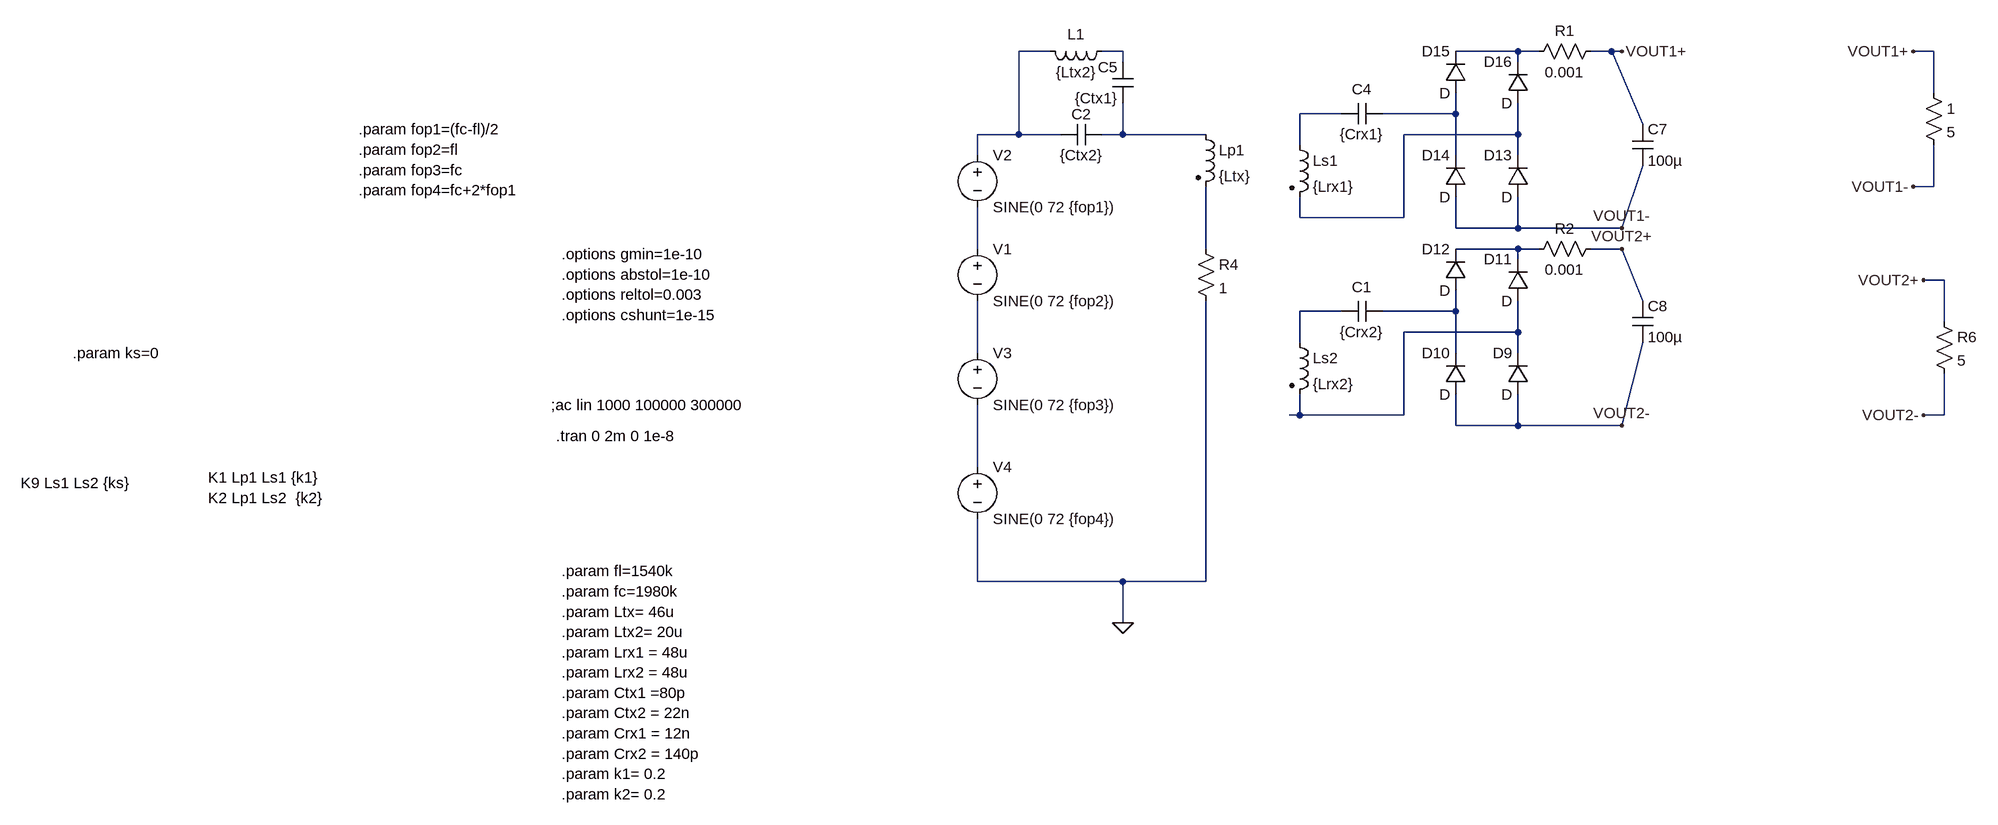
[diagram p0: schematic 1p2S_sine.asc]
1p2S_sine.asc, the LTspice schematic file:
Version 4
SHEET 1 3864 3572
WIRE 960 512 912 512
WIRE 1072 512 1040 512
WIRE 1680 512 1584 512
WIRE 1712 512 1680 512
WIRE 1824 512 1792 512
WIRE 1840 512 1824 512
WIRE 2320 512 2288 512
WIRE 1072 528 1072 512
WIRE 1680 528 1680 512
WIRE 2320 576 2320 512
WIRE 1408 608 1344 608
WIRE 1584 608 1584 576
WIRE 1584 608 1472 608
WIRE 1872 624 1824 512
WIRE 912 640 912 512
WIRE 912 640 848 640
WIRE 976 640 912 640
WIRE 1072 640 1072 592
WIRE 1072 640 1040 640
WIRE 1200 640 1072 640
WIRE 1680 640 1680 592
WIRE 1680 640 1504 640
WIRE 1344 656 1344 608
WIRE 848 672 848 640
WIRE 1584 672 1584 608
WIRE 1680 672 1680 640
WIRE 2320 720 2320 656
WIRE 2320 720 2288 720
WIRE 1344 768 1344 736
WIRE 1504 768 1504 640
WIRE 1504 768 1344 768
WIRE 1584 784 1584 736
WIRE 1680 784 1680 736
WIRE 1680 784 1584 784
WIRE 1840 784 1872 688
WIRE 1840 784 1680 784
WIRE 848 816 848 752
WIRE 1200 816 1200 720
WIRE 1680 816 1584 816
WIRE 1712 816 1680 816
WIRE 1840 816 1792 816
WIRE 1680 832 1680 816
WIRE 2336 864 2304 864
WIRE 1872 896 1840 816
WIRE 1408 912 1344 912
WIRE 1584 912 1584 880
WIRE 1584 912 1472 912
WIRE 2336 928 2336 864
WIRE 1680 944 1680 896
WIRE 1680 944 1504 944
WIRE 1344 960 1344 912
WIRE 848 976 848 896
WIRE 1584 976 1584 912
WIRE 1680 976 1680 944
WIRE 1344 1072 1344 1040
WIRE 1344 1072 1328 1072
WIRE 1504 1072 1504 944
WIRE 1504 1072 1344 1072
WIRE 2336 1072 2336 1008
WIRE 2336 1072 2304 1072
WIRE 1584 1088 1584 1040
WIRE 1680 1088 1680 1040
WIRE 1680 1088 1584 1088
WIRE 1840 1088 1872 960
WIRE 1840 1088 1680 1088
WIRE 848 1152 848 1056
WIRE 848 1328 848 1232
WIRE 1072 1328 848 1328
WIRE 1200 1328 1200 896
WIRE 1200 1328 1072 1328
WIRE 1072 1392 1072 1328
FLAG 1840 512 VOUT1+
FLAG 1840 784 VOUT1-
FLAG 1840 816 VOUT2+
FLAG 1840 1088 VOUT2-
FLAG 2304 864 VOUT2+
FLAG 2304 1072 VOUT2-
FLAG 1072 1392 0
FLAG 2288 512 VOUT1+
FLAG 2288 720 VOUT1-
SYMBOL ind2 1184 624 R0
SYMATTR InstName Lp1
SYMATTR Value {Ltx}
SYMATTR Type ind
SYMBOL ind2 1328 640 R0
SYMATTR InstName Ls1
SYMATTR Value {Lrx1}
SYMATTR Type ind
SYMBOL cap 1472 592 R90
WINDOW 0 -6 32 VBottom 2
WINDOW 3 32 32 VTop 2
SYMATTR InstName C4
SYMATTR Value {Crx1}
SYMBOL diode 1696 736 R180
WINDOW 0 24 64 Left 2
WINDOW 3 24 0 Left 2
SYMATTR InstName D13
SYMBOL diode 1600 736 R180
WINDOW 0 24 64 Left 2
WINDOW 3 24 0 Left 2
SYMATTR InstName D14
SYMBOL diode 1696 592 R180
WINDOW 0 24 64 Left 2
WINDOW 3 24 0 Left 2
SYMATTR InstName D16
SYMBOL diode 1600 576 R180
WINDOW 0 24 64 Left 2
WINDOW 3 24 0 Left 2
SYMATTR InstName D15
SYMBOL ind2 1328 944 R0
SYMATTR InstName Ls2
SYMATTR Value {Lrx2}
SYMATTR Type ind
SYMBOL cap 1472 896 R90
WINDOW 0 -6 32 VBottom 2
WINDOW 3 32 32 VTop 2
SYMATTR InstName C1
SYMATTR Value {Crx2}
SYMBOL diode 1696 1040 R180
WINDOW 0 24 64 Left 2
WINDOW 3 24 0 Left 2
SYMATTR InstName D9
SYMBOL diode 1600 1040 R180
WINDOW 0 24 64 Left 2
WINDOW 3 24 0 Left 2
SYMATTR InstName D10
SYMBOL diode 1696 896 R180
WINDOW 0 24 64 Left 2
WINDOW 3 24 0 Left 2
SYMATTR InstName D11
SYMBOL diode 1600 880 R180
WINDOW 0 24 64 Left 2
WINDOW 3 24 0 Left 2
SYMATTR InstName D12
SYMBOL cap 1856 624 R0
SYMATTR InstName C7
SYMATTR Value 100µ
SYMBOL cap 1856 896 R0
SYMATTR InstName C8
SYMATTR Value 100µ
SYMBOL res 2320 912 R0
SYMATTR InstName R6
SYMATTR Value 5
SYMBOL res 1808 496 R90
WINDOW 0 0 56 VBottom 2
WINDOW 3 32 56 VTop 2
SYMATTR InstName R1
SYMATTR Value 0.001
SYMBOL res 1808 800 R90
WINDOW 0 0 56 VBottom 2
WINDOW 3 32 56 VTop 2
SYMATTR InstName R2
SYMATTR Value 0.001
SYMBOL voltage 848 656 R0
WINDOW 123 0 0 Left 0
WINDOW 39 0 0 Left 0
SYMATTR InstName V2
SYMATTR Value SINE(0 72 {fop1})
SYMBOL voltage 848 800 R0
WINDOW 123 0 0 Left 0
WINDOW 39 0 0 Left 0
SYMATTR InstName V1
SYMATTR Value SINE(0 72 {fop2})
SYMBOL voltage 848 960 R0
WINDOW 123 0 0 Left 0
WINDOW 39 0 0 Left 0
SYMATTR InstName V3
SYMATTR Value SINE(0 72 {fop3})
SYMBOL voltage 848 1136 R0
WINDOW 123 0 0 Left 0
WINDOW 39 0 0 Left 0
SYMATTR InstName V4
SYMATTR Value SINE(0 72 {fop4})
SYMBOL res 2304 560 R0
SYMATTR InstName 1
SYMATTR Value 5
SYMBOL res 1184 800 R0
SYMATTR InstName R4
SYMATTR Value 1
SYMBOL cap 1040 624 R90
WINDOW 0 0 32 VBottom 2
WINDOW 3 32 32 VTop 2
SYMATTR InstName C2
SYMATTR Value {Ctx2}
SYMBOL ind 1056 496 R90
WINDOW 0 5 56 VBottom 2
WINDOW 3 32 56 VTop 2
SYMATTR InstName L1
SYMATTR Value {Ltx2}
SYMBOL cap 1088 592 R180
WINDOW 0 24 56 Left 2
WINDOW 3 24 8 Left 2
SYMATTR InstName C5
SYMATTR Value {Ctx1}
TEXT 200 1104 Left 2 !.tran 0 2m 0 1e-8
TEXT 208 1312 Left 2 !.param fl=1540k  \n.param fc=1980k\n.param Ltx= 46u\n.param Ltx2= 20u\n.param Lrx1 = 48u\n.param Lrx2 = 48u\n.param Ctx1 =80p \n.param Ctx2 = 22n\n.param Crx1 = 12n\n.param Crx2 = 140p\n.param k1= 0.2\n.param k2= 0.2
TEXT 192 1056 Left 2 !;ac lin 1000 100000 300000
TEXT -104 632 Left 2 !.param fop1=(fc-fl)/2\n.param fop2=fl\n.param fop3=fc\n.param fop4=fc+2*fop1
TEXT 208 824 Left 2 !.options gmin=1e-10   \n.options abstol=1e-10  \n.options reltol=0.003  \n.options cshunt=1e-15
TEXT -336 1168 Left 2 !K1 Lp1 Ls1 {k1}\nK2 Lp1 Ls2  {k2}
TEXT -624 1176 Left 2 !K9 Ls1 Ls2 {ks}
TEXT -544 976 Left 2 !.param ks=0

The netlist it stands for:
* 1p2S_sine.asc
Lp1 N006 N009 {Ltx}
Ls1 N004 N007 {Lrx1}
C4 N005 N004 {Crx1}
D13 VOUT1- N007 D
D14 VOUT1- N005 D
D16 N007 N003 D
D15 N005 N003 D
Ls2 N011 N013 {Lrx2}
C1 N012 N011 {Crx2}
D9 VOUT2- N013 D
D10 VOUT2- N012 D
D11 N013 N010 D
D12 N012 N010 D
C7 VOUT1+ VOUT1- 100µ
C8 VOUT2+ VOUT2- 100µ
R6 VOUT2+ VOUT2- 5
R1 VOUT1+ N003 0.001
R2 VOUT2+ N010 0.001
V2 N001 N008 SINE(0 72 {fop1})
V1 N008 N014 SINE(0 72 {fop2})
V3 N014 N015 SINE(0 72 {fop3})
V4 N015 0 SINE(0 72 {fop4})
R§1 VOUT1+ VOUT1- 5
R4 N009 0 1
C2 N006 N001 {Ctx2}
L1 N002 N001 {Ltx2}
C5 N006 N002 {Ctx1}
.model D D
.lib standard.dio
.tran 0 2m 0 1e-8
.param fl=1540k
.param fc=1980k
.param Ltx= 46u
.param Ltx2= 20u
.param Lrx1 = 48u
.param Lrx2 = 48u
.param Ctx1 =80p
.param Ctx2 = 22n
.param Crx1 = 12n
.param Crx2 = 140p
.param k1= 0.2
.param k2= 0.2
;ac lin 1000 100000 300000
.param fop1=(fc-fl)/2
.param fop2=fl
.param fop3=fc
.param fop4=fc+2*fop1
.options gmin=1e-10
.options abstol=1e-10
.options reltol=0.003
.options cshunt=1e-15
K1 Lp1 Ls1 {k1}
K2 Lp1 Ls2  {k2}
K9 Ls1 Ls2 {ks}
.param ks=0
.backanno
.end